# EasyEDA schematic SCH_FlopperZiro_2024-01-12.json
TITLE: Flopper Ziro; REV: 1.1; Date: 2024-01-12; Sheet: 1/1; Drawn By: iraton; Company: TechIaton
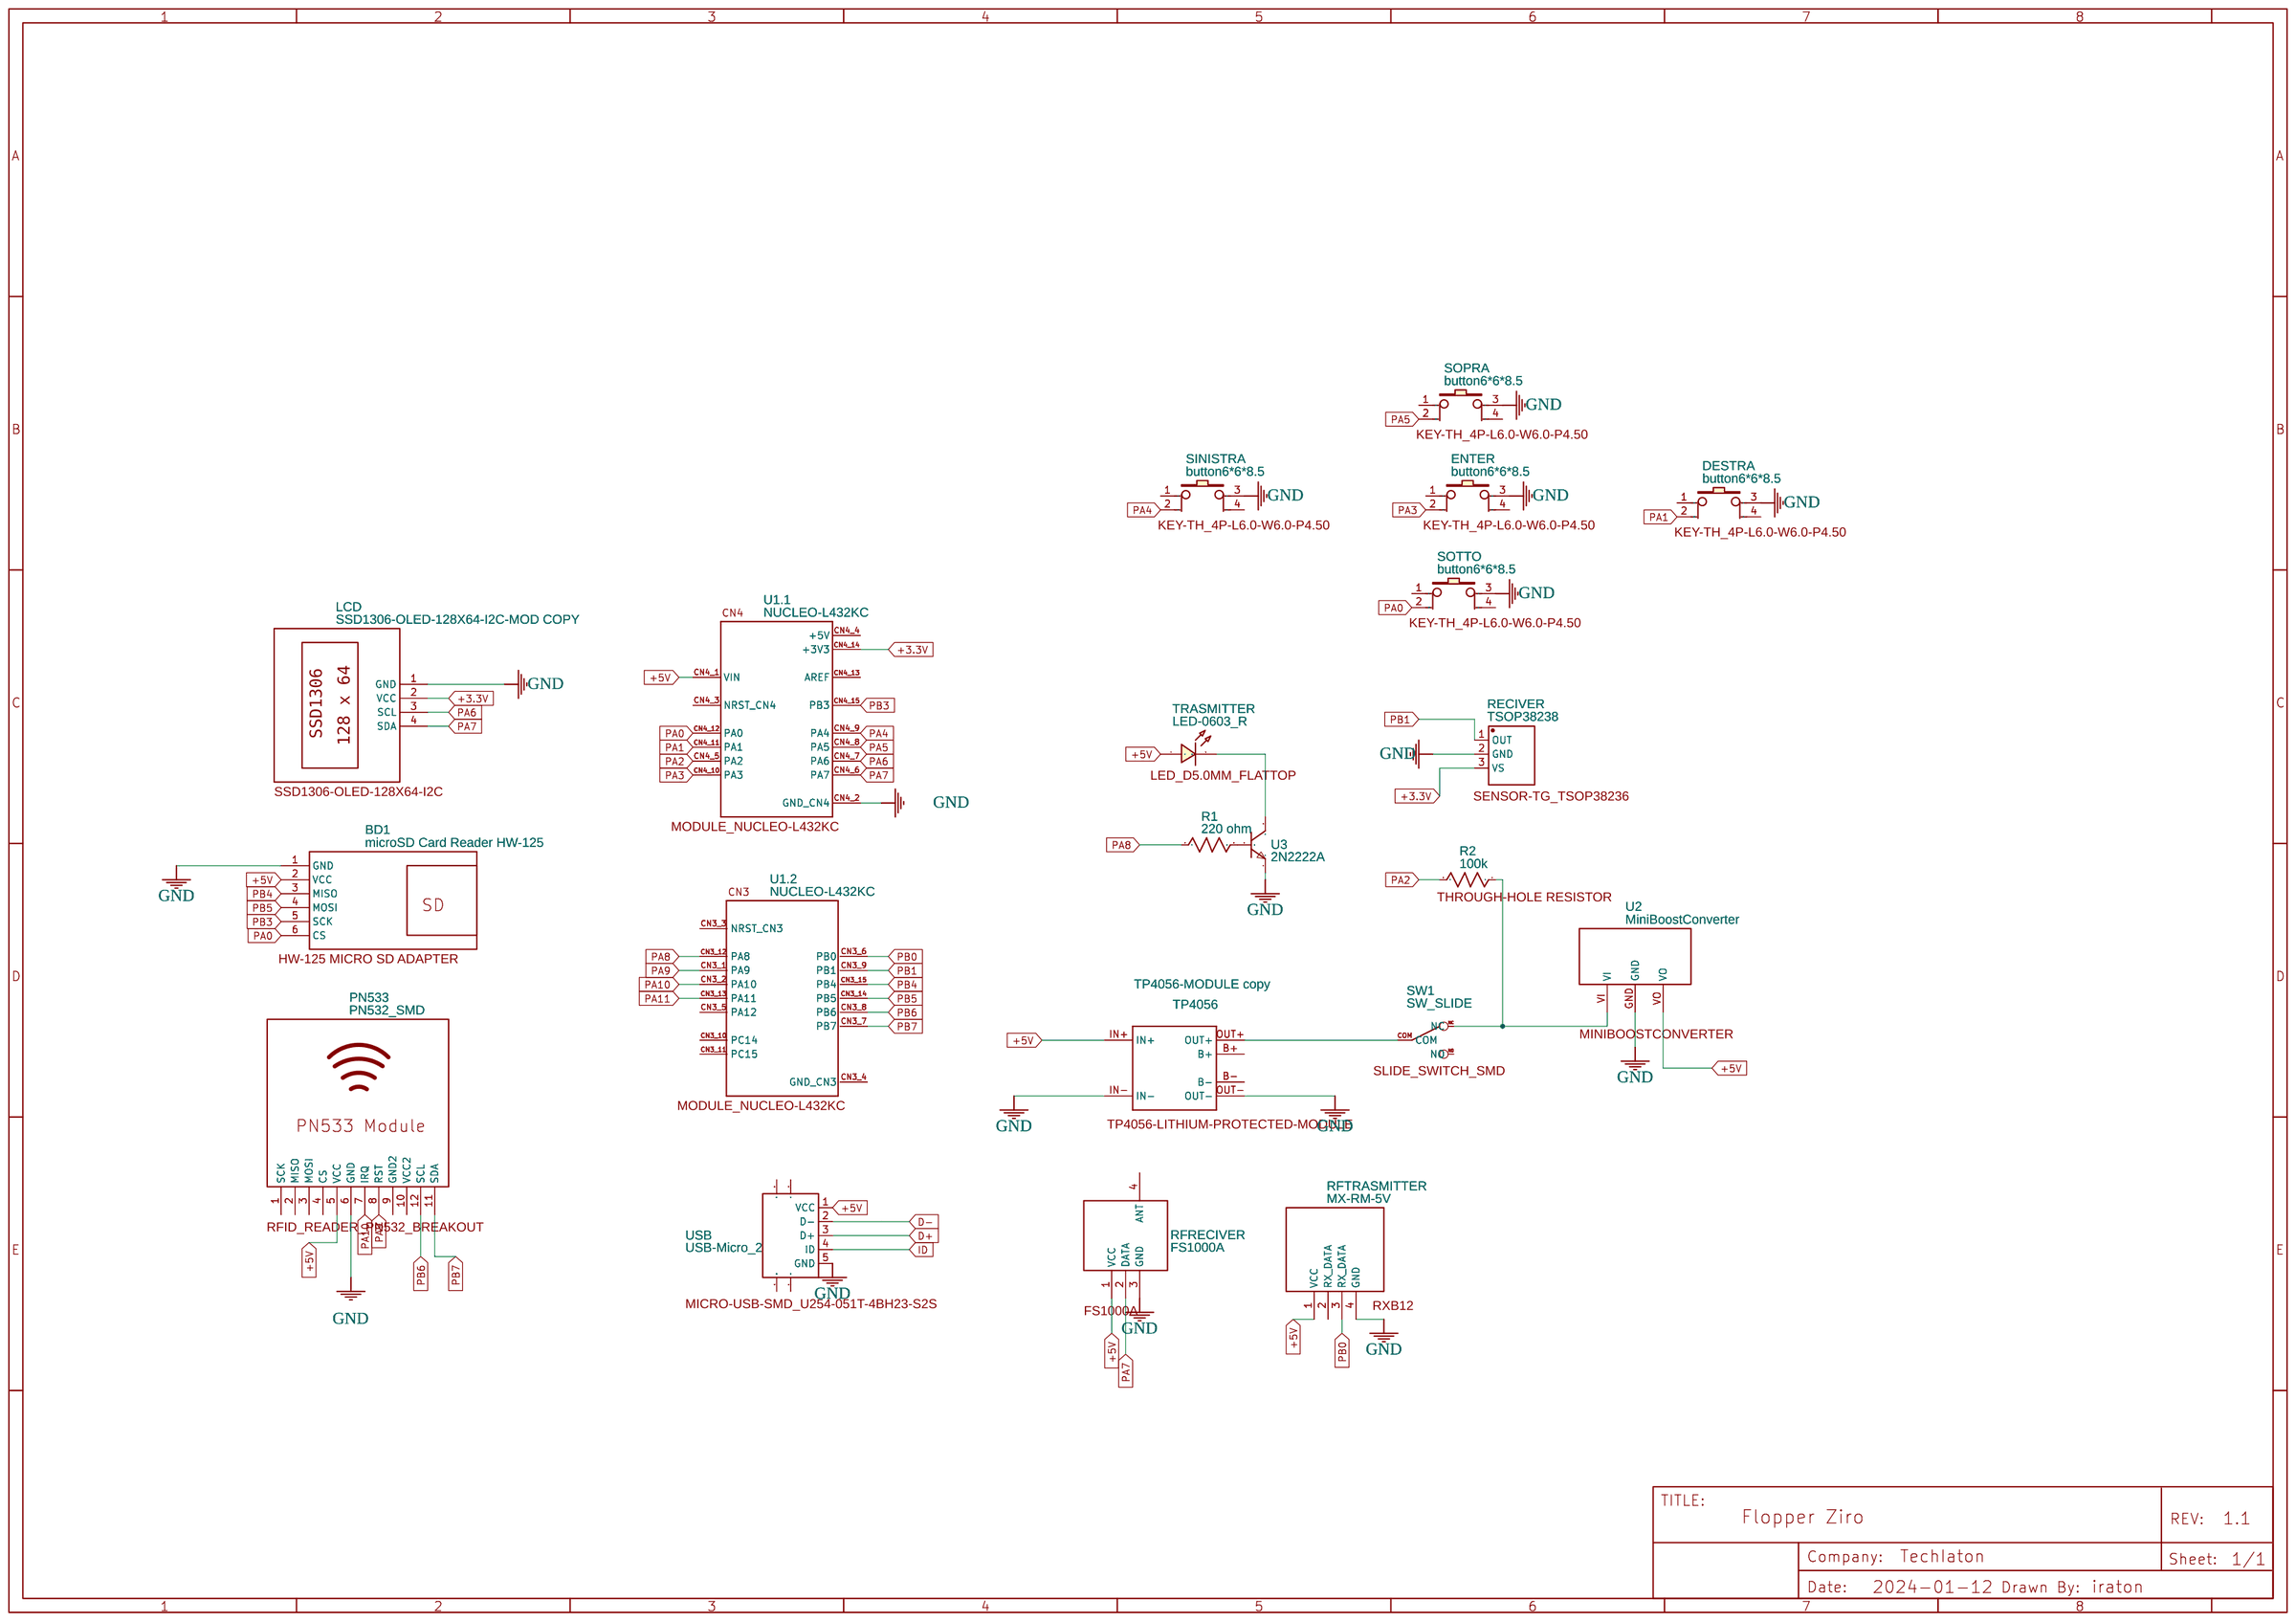
[diagram p0: schematic sheet]

## Parts
BD1  microSD Card Reader HW-125  [HW-125 MICRO SD ADAPTER]
DESTRA  button6*6*8.5  [KEY-TH_4P-L6.0-W6.0-P4.50]
ENTER  button6*6*8.5  [KEY-TH_4P-L6.0-W6.0-P4.50]
LCD  SSD1306-OLED-128X64-I2C-MOD COPY  [SSD1306-OLED-128X64-I2C]
PN533  PN532_SMD  [RFID_READER_PN532_BREAKOUT]
R1  220 ohm  [THROUGH-HOLE RESISTOR]
R2  100k  [THROUGH-HOLE RESISTOR]
RECIVER  TSOP38238  [SENSOR-TG_TSOP38236]
RFRECIVER  FS1000A  [FS1000A]
RFTRASMITTER  MX-RM-5V  [RXB12]
SINISTRA  button6*6*8.5  [KEY-TH_4P-L6.0-W6.0-P4.50]
SOPRA  button6*6*8.5  [KEY-TH_4P-L6.0-W6.0-P4.50]
SOTTO  button6*6*8.5  [KEY-TH_4P-L6.0-W6.0-P4.50]
SW1  SW_SLIDE  [SLIDE_SWITCH_SMD]
TP4056  TP4056-MODULE copy  [TP4056-LITHIUM-PROTECTED-MODULE]
TRASMITTER  LED-0603_R  [LED_D5.0MM_FLATTOP]
U1  NUCLEO-L432KC  [MODULE_NUCLEO-L432KC]  (sections 1,2)
U2  MiniBoostConverter  [MINIBOOSTCONVERTER]
U3  2N2222A  [TO-18_BD5.4-P2.54_C3018942]
USB  USB-Micro_2  [MICRO-USB-SMD_U254-051T-4BH23-S2S]

## Library data of the parts
BD1 = microSD Card Reader HW-125: Contributor: roddog; Package Display: Yes
DESTRA ENTER SINISTRA SOPRA SOTTO = button6*6*8.5: Supplier Part: C59980; Supplier: LCSC; Manufacturer: ReliaPro; Package Display: Yes
LCD = SSD1306-OLED-128X64-I2C-MOD COPY: Contributor: Karas; Package Display: Yes
PN533 = PN532_SMD: Supplier Part: C49256; Supplier: LCSC; Manufacturer: ReliaPro; Manufacturer Part: Header2.54mm 1*8P; Contributor: JFK422; Package Display: Yes
R1 = R_0603_US: Contributor: LCEDA_Lib; Package Display: No
R2 = R_0603_US: Contributor: LCEDA_Lib; Package Display: Yes
RECIVER = TSOP38238: Supplier: LCSC; Manufacturer: VISHAY; Contributor: LCSC; Supplier Part: C141632; JLCPCB Part Class: Extended Part; Package Display: Yes
RFRECIVER = FS1000A: Contributor: ZaharSH; Package Display: Yes
RFTRASMITTER = MX-RM-5V: Contributor: ZaharSH; Package Display: Yes
SW1 = SW_SLIDE: Contributor: DangerousPrototype; Package Display: Yes
TP4056 = TP4056-MODULE copy: null; Package Display: Yes
TRASMITTER = LED-0603_R: Manufacturer: EVERLIGHT(台湾亿光); Manufacturer Part: 19-217/R6C-AL1M2VY/3T; Supplier Part: C72044; Supplier: LCSC; Contributor: LCEDA_01; Package Display: Yes
U1 = NUCLEO-L432KC: Contributor: iraton; subpart_no: 1; Package Display: Yes
U2 = MiniBoostConverter: Contributor: enni9095; Package Display: Yes
U3 = 2N2222A_C3018942: Contributor: lcsc; Supplier: LCSC; Supplier Part: C3018942; Manufacturer: null
USB = USB-Micro_2: Supplier Part: C40957; Supplier: LCSC; Manufacturer: ValuePro; Contributor: LCEDA_Lib; Package Display: Yes

## Nets
+3.3V: LCD.2(VCC) RECIVER.3(VS) U1.CN4_14(+3V3)
+5V: BD1.2(VCC) PN533.5(VCC) RFRECIVER.1(VCC) RFTRASMITTER.1(VCC) TP4056.IN+ TRASMITTER.1 U1.CN4_1(VIN) U2.VO USB.1(VCC)
GND: BD1.1(GND) DESTRA.3 ENTER.3 LCD.1(GND) PN533.6(GND) RECIVER.2(GND) RFRECIVER.3(GND) RFTRASMITTER.4(GND) SINISTRA.3 SOPRA.3 SOTTO.3 TP4056.IN- TP4056.OUT- U1.CN4_2(GND_CN4) U2.GND U3.1(E) USB.5(GND)
D+: USB.3(D+)
D-: USB.2(D-)
ID: USB.4(ID)
PA0: BD1.6(CS) SOTTO.2 U1.CN4_12(PA0)
PA1: DESTRA.2 U1.CN4_11(PA1)
PA2: R2.2 U1.CN4_5(PA2)
PA3: ENTER.2 U1.CN4_10(PA3)
PA4: SINISTRA.2 U1.CN4_9(PA4)
PA5: SOPRA.2 U1.CN4_8(PA5)
PA6: LCD.3(SCL) U1.CN4_7(PA6)
PA7: LCD.4(SDA) RFRECIVER.2(DATA) U1.CN4_6(PA7)
PA8: R1.1 U1.CN3_12(PA8)
PA9: PN533.8(RST) U1.CN3_1(PA9)
PA10: PN533.7(IRQ) U1.CN3_2(PA10)
PA11: U1.CN3_13(PA11)
PB0: RFTRASMITTER.3(RX_DATA) U1.CN3_6(PB0)
PB1: RECIVER.1(OUT) U1.CN3_9(PB1)
PB3: BD1.5(SCK) U1.CN4_15(PB3)
PB4: BD1.3(MISO) U1.CN3_15(PB4)
PB5: BD1.4(MOSI) U1.CN3_14(PB5)
PB6: PN533.12(SCL) U1.CN3_8(PB6)
PB7: PN533.11(SDA) U1.CN3_7(PB7)
Net-(R1-2): R1.2 U3.2(B)
Net-(R2-1): R2.1 SW1.NC U2.VI
Net-(SW1-COM): SW1.COM TP4056.OUT+
Net-(TRASMITTER-2): TRASMITTER.2 U3.3(C)

Not connected (* = marked no-connect by the designer): DESTRA 1 4; ENTER 1 4; PN533 1(SCK) 2(MISO) 3(MOSI) 4(CS) 9(GND2) 10(VCC2); RFRECIVER 4(ANT); RFTRASMITTER 2(RX_DATA); SINISTRA 1 4; SOPRA 1 4; SOTTO 1 4; SW1 NO; TP4056 B+ B-; U1 CN3_3(NRST_CN3) CN3_4(GND_CN3) CN3_5(PA12) CN3_10(PC14) CN3_11(PC15) CN4_3(NRST_CN4) CN4_4(+5V) CN4_13(AREF); USB 6(SH4)
